# EAGLE design k1fm_wspr_tx-1.0 (EAGLE 9.2.2)
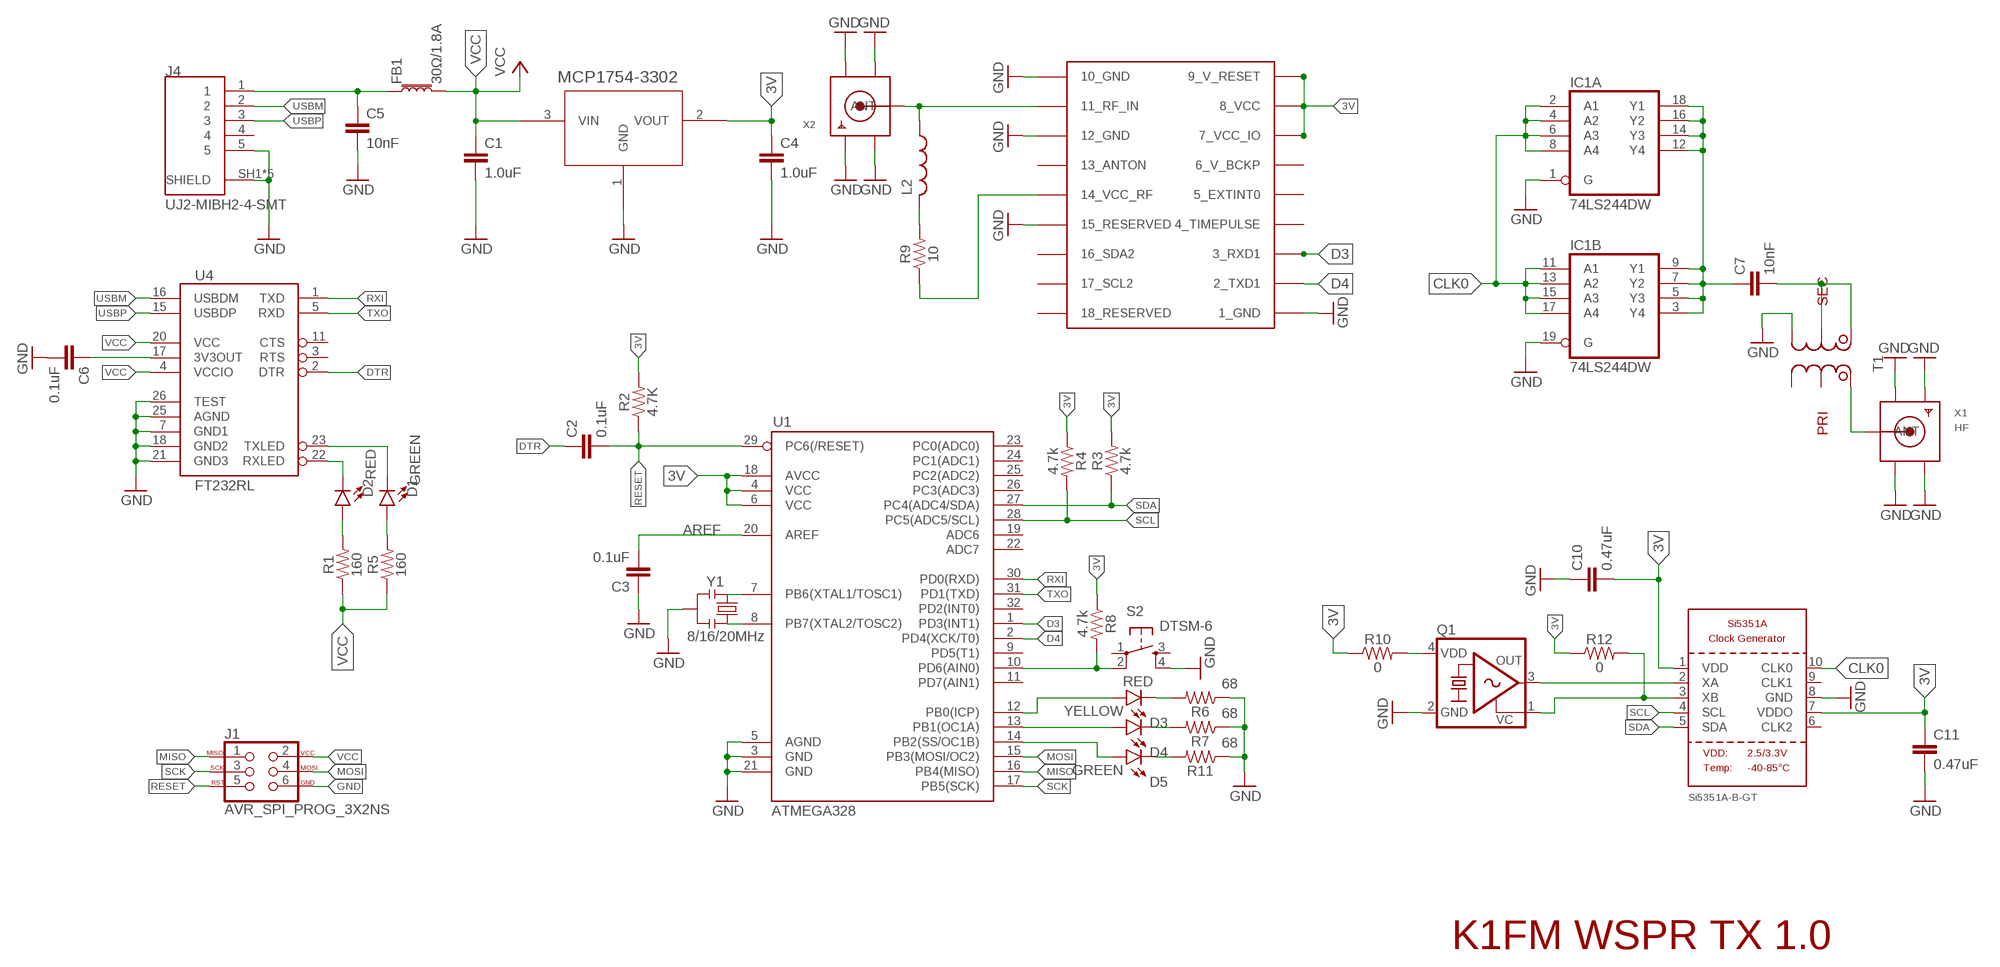
[diagram p0: schematic, sheet 1]

## Parts
C1  1.0uF  1.0UF-0603-16V-10%  [0603]
C2  0.1uF  0.1UF-0603-25V-5%  [0603]
C3  0.1uF  0.1UF-0603-25V-5%  [0603]
C4  1.0uF  1.0UF-0603-16V-10%  [0603]
C5  10nF  1.0UF-0603-16V-10%  [0603]
C6  0.1uF  0.1UF-0603-25V-5%  [0603]
C7  10nF  1.0UF-0603-16V-10%  [0603]
C10  0.47uF  0.1UF-0603-25V-5%  [0603]
C11  0.47uF  0.1UF-0603-25V-5%  [0603]
D1  GREEN  LED0603  [LED-0603]
D2  RED  LED0603  [LED-0603]
D3  RED  LED0603  [LED-0603]
D4  YELLOW  LED0603  [LED-0603]
D5  GREEN  LED0603  [LED-0603]
FB1  30Ω/1.8A  FERRITE_BEAD-0603  [0603]
GPS1  UBLOX_MAX  [UBLOX_MAX]
IC1  74LS244DW  [SO20W]
J1  AVR_SPI_PROG_3X2NS  [2X3-NS]
J4  UJ2-MIBH2-4-SMT  [CUI_UJ2-MIBH2-4-SMT]
L2  INDUCTOR_0402_M  [RESC0402_M]
Q1  KXO-VCXO-SINE-84  [3.2X2.5_KXO-84]
R1  160  4.7KOHM-0603-1/10W-1%  [0603]
R2  4.7K  10KOHM-0603-1/10W-1%  [0603]
R3  4.7k  4.7KOHM-0603-1/10W-1%  [0603]
R4  4.7k  4.7KOHM-0603-1/10W-1%  [0603]
R5  160  4.7KOHM-0603-1/10W-1%  [0603]
R6  68  4.7KOHM-0603-1/10W-1%  [0603]
R7  68  4.7KOHM-0603-1/10W-1%  [0603]
R8  4.7k  4.7KOHM-0603-1/10W-1%  [0603]
R9  10  10KOHM-0603-1/10W-1%  [0603]
R10  0  4.7KOHM-0603-1/10W-1%  [0603]
R11  68  4.7KOHM-0603-1/10W-1%  [0603]
R12  0  4.7KOHM-0603-1/10W-1%  [0603]
S2  DTSM-6  [DTSM-6]
T1  TT1-6  [KK81]
U1  ATMEGA328  ATMEGA168  [TQFP32-08]
U2  Si5351A-B-GT  SI5351A  [MSOP10]
U3  MCP1754X-XXXXX/C  [SOT-23A_MC]
U4  FT232RL  FT232RL-BASICSSOP  [SSOP28DB]
X1  HF  SMACONNECTOR_EDGE  [SMA_EDGELAUNCH]
X2  SMACONNECTOR_EDGE  [SMA_EDGELAUNCH]
Y1  8/16/20MHz  RESONATOR1:1  [RESONATOR-SMD-1:1]

## Nets
3V: C4.1 C10.2 C11.1 GPS1.7_VCC_IO GPS1.8_VCC GPS1.9_V_RESET R2.2 R3.2 R4.1 R8.1 R10.1 R12.1 U1.4(VCC) U1.6(VCC) U1.18(AVCC) U2.1(VDD) U2.7(VDDO) U3.2(VOUT)
AREF: C3.2 U1.20(AREF)
CLK0: IC1.2(A:A1) IC1.4(A:A2) IC1.6(A:A3) IC1.8(A:A4) IC1.11(B:A1) IC1.13(B:A2) IC1.15(B:A3) IC1.17(B:A4) U2.10(CLK0)
D3: GPS1.3_RXD1 U1.1(PD3(INT1))
D4: GPS1.2_TXD1 U1.2(PD4(XCK/T0))
DTR: C2.1 U4.2(DTR)
GND: C1.2 C3.1 C4.2 C5.2 C6.2 C10.1 C11.2 GPS1.1_GND GPS1.10_GND GPS1.12_GND GPS1.15_RESERVED IC1.1(A:G) IC1.19(B:G) J1.6 J4.5 J4.SH1(SHIELD) J4.SH2(SHIELD) J4.SH3(SHIELD) J4.SH4(SHIELD) J4.SH5(SHIELD) Q1.2(GND) R6.1 R7.1 R11.1 S2.4 T1.1(S2) U1.3(GND) U1.5(AGND) U1.21(GND) U2.8(GND) U3.1(GND) U4.7(GND1) U4.18(GND2) U4.21(GND3) U4.25(AGND) U4.26(TEST) X1.GND@1(GND4) X1.GND@2(GND3) X1.GND@3(GND2) X1.GND@4(GND1) X2.GND@1(GND4) X2.GND@2(GND3) X2.GND@3(GND2) X2.GND@4(GND1) Y1.2
MISO: J1.1 U1.16(PB4(MISO))
MOSI: J1.4 U1.15(PB3(MOSI/OC2))
N$1: GPS1.11_RF_IN L2.1 X2.P(ANT)
N$2: D2.C U4.22(RXLED)
N$3: C7.1 IC1.3(B:Y4) IC1.5(B:Y3) IC1.7(B:Y2) IC1.9(B:Y1) IC1.12(A:Y4) IC1.14(A:Y3) IC1.16(A:Y2) IC1.18(A:Y1)
N$4: T1.4(P1) X1.P(ANT)
N$5: C7.2 T1.2(ST) T1.3(S1)
N$6: Q1.3(OUT) U2.2(XA)
N$7: D1.C U4.23(TXLED)
N$8: C5.1 FB1.1 J4.1
N$9: D2.A R1.2
N$10: D1.A R5.2
N$11: D3.A U1.12(PB0(ICP))
N$12: D4.A U1.13(PB1(OC1A))
N$13: D3.C R6.2
N$14: C6.1 U4.17(3V3OUT)
N$15: D4.C R7.2
N$16: R8.2 S2.2 U1.10(PD6(AIN0))
N$17: L2.2 R9.2
N$18: GPS1.14_VCC_RF R9.1
N$19: Q1.1(VC) R12.2 U2.3(XB)
N$20: Q1.4(VDD) R10.2
N$21: D5.A U1.14(PB2(SS/OC1B))
N$22: D5.C R11.2
N$28: U1.8(PB7(XTAL2/TOSC2)) Y1.3
N$29: U1.7(PB6(XTAL1/TOSC1)) Y1.1
RESET: C2.2 J1.5 R2.1 U1.29(PC6(/RESET))
RXI: U1.30(PD0(RXD)) U4.1(TXD)
SCK: J1.3 U1.17(PB5(SCK))
SCL: R4.2 U1.28(PC5(ADC5/SCL)) U2.4(SCL)
SDA: R3.1 U1.27(PC4(ADC4/SDA)) U2.5(SDA)
TXO: U1.31(PD1(TXD)) U4.5(RXD)
USBM: J4.2 U4.16(USBDM)
USBP: J4.3 U4.15(USBDP)
VCC: C1.1 FB1.2 J1.2 R1.1 R5.1 U3.3(VIN) U4.4(VCCIO) U4.20(VCC)
Unconnected: GPS1.4_TIMEPULSE GPS1.5_EXTINT0 GPS1.6_V_BCKP GPS1.13_ANTON GPS1.16_SDA2 GPS1.17_SCL2 GPS1.18_RESERVED J4.4 S2.1 S2.3 T1.5(PT) T1.6(P2) U1.9(PD5(T1)) U1.11(PD7(AIN1)) U1.19(ADC6) U1.22(ADC7) U1.23(PC0(ADC0)) U1.24(PC1(ADC1)) U1.25(PC2(ADC2)) U1.26(PC3(ADC3)) U1.32(PD2(INT0)) U2.6(CLK2) U2.9(CLK1) U4.3(RTS) U4.11(CTS)

## Notes on the sheet
- K1FM WSPR TX 1.0

## Power pins joined to a net without a drawn wire
GND: IC1.10(P:GND)
VCC: IC1.20(P:VCC)

## Library data of the parts
C1 C4 = SparkFun-Capacitors:1.0UF: 1µF ceramic capacitors A capacitor is a passive two-terminal electrical component used to store electrical energy temporarily in an electric field.; PROD_ID: CAP-00868
C2 C3 C6 = SparkFun-Capacitors:0.1UF: 0.1µF ceramic capacitors A capacitor is a passive two-terminal electrical component used to store electrical energy temporarily in an electric field.; PROD_ID: CAP-08604
C5 C7 = SparkFun-Capacitors:1.0UF: 1µF ceramic capacitors A capacitor is a passive two-terminal electrical component used to store electrical energy temporarily in an electric field.; PROD_ID: CAP-00868; VALUE: 1.0uF
C10 C11 = SparkFun-Capacitors:0.1UF: 0.1µF ceramic capacitors A capacitor is a passive two-terminal electrical component used to store electrical energy temporarily in an electric field.; PROD_ID: CAP-08604; VALUE: 0.1uF
D1-D5 = SparkFun-LED:LED: LED (Generic) Standard schematic elements and footprints for 5mm, 3mm, 1206, and 0603 sized LEDs. Generic LEDs with no color specified.
FB1 = SparkFun-Coils:FERRITE_BEAD: Ferrite Bead (blocks, cores, rings, chokes, etc.) Inductor with layers of ferrite used to suppress high frequencies. Often used to isolate high frequency noise. SparkFun Products: IOIO-OTG - V2.2 <https://www.sparkfun.com/products/13613> SparkFun SAMD21 Mini Breakout <https://www.sparkfun.com/products/13664> SparkFun 6 Degrees of Freedom Breakout - LSM6DS3 <https://www.sparkfun.com/products/13339> SparkFun SAMD21 Dev Breakout <https://www.sparkfun.com/products/13672>; PROD_ID: NDUC-07859
GPS1 = Ava:UBLOX_MAX: UBLOX MAX
IC1 = 74xx-us:74*244: Octal BUFFER and LINE DRIVER, 3-state
J1 = SparkFun-Connectors:AVR_SPI_PROG_3X2: AVR ISP 6 Pin This is the reduced ISP connector for AVR programming. Common on Arduino. This footprint will take up less PCB space and can be used with a 10-pin to 6-pin adapter such as SKU: BOB-08508 **Special note about "TEST_POINT" package. The stop mask is on the top side, so if you want your programming test points to be on the bottom of your board, make sure to place this package on the bottom side of the board. This also ensure that the orientation to program from the bottom side will be correct. SparkFun Products: SparkFun ISP Pogo Adapter <https://www.sparkfun.com/products/11591> - NS Tiny AVR Programmer <https://www.sparkfun.com/products/11801> -PTH
J4 = UJ2-MIBH2-4-SMT:UJ2-MIBH2-4-SMT: Micro B, USB 2.0, 1.8 A, Right Angle, Surface Mount (SMT), USB Receptacle; MANUFACTURER: CUI INC; PART_REV: 1.0; STANDARD: MANUFACTURER RECOMMENDATIONS
L2 = Nordic_nRF:INDUCTOR: Generic chip inductor
Q1 = crystal-geyer_V1_0:KXO-VCXO-SINE: VCXO : Sinewave - Serie Model Size l/w/h [mm] Frequency Range Frequency Stability Temp. Range [°C] Output AECQ 200 availabel Datasheet KXO-81 KXO-86 KXO-84 KXO-83 KXO-82 2.0/1.6/0.7 2.5/2.0/0.7 3.2/2.5/1.0 5.0/3.2/1.5 7.0/5.0/2.0 13,0 ~ 40,0 MHz 13,0 ~ 40,0 MHz 10,0 ~ 26,0 MHz 12,0 ~ 26,0 MHz 12,6 ~ 20,0 MHz ±10 … ±50ppm ±10 … ±50ppm ±10 … ±50ppm ±10 … ±50ppm ±10 … ±50ppm (*) -30°C …+75°C (*) -30°C …+75°C (*) -40°C …+85°C (*) -40°C …+85°C (*) -30°C …+80°C Sinewave Sinewave Sinewave Sinewave Sinewave - - - - - KXO-81.pdf <http://www.geyer-electronic.de/uploads/tx_userartikelfrequenz/GEYER-KXO-81-VCXO-sinewave.pdf> KXO-86.pdf <http://www.geyer-electronic.de/uploads/tx_userartikelfrequenz/GEYER-KXO-86-VCXO-sinewave.pdf> KXO-84.pdf <http://www.geyer-electronic.de/uploads/tx_userartikelfrequenz/GEYER-KXO-84-VCXO-sinewave.pdf> KXO-83.pdf <http://www.geyer-electronic.de/uploads/tx_userartikelfrequenz/GEYER-KXO-83-VCXO-sinewave.pdf> KXO-82.pdf <http://www.geyer-electronic.de/uploads/tx_userartikelfrequenz/GEYER-KXO-82-VCXO-sinewave.pdf> <http://www.geyer-electronic.de/fileadmin/template/img/logo-geyer-electronic.png> Details see: http://www.geyer-electronic.de/Frequenz-Produkte.9.0.html Created 2016-06-07, Hans Locher 2016 (C) Geyer Quartz Technology KXO81,KXO86,KXO84,KXO83,KXO82,2,0x1,6;2.0x1.6;2,5x2,0;2.5x2.0;3,2x2,5;3.2x2.5;5,0x3,2;5.0x3.2;7,0x5,0;7.0x5.0;2016;2520;3225;5032;7050
R1 R5-R7 R10-R12 = SparkFun-Resistors:4.7KOHM: 4.7kΩ resistor A resistor is a passive two-terminal electrical component that implements electrical resistance as a circuit element. Resistors act to reduce current flow, and, at the same time, act to lower voltage levels within circuits. - Wikipedia; PROD_ID: RES-07857; VALUE: 4.7k
R2 R9 = SparkFun-Resistors:10KOHM: 10kΩ resistor A resistor is a passive two-terminal electrical component that implements electrical resistance as a circuit element. Resistors act to reduce current flow, and, at the same time, act to lower voltage levels within circuits. - Wikipedia; PROD_ID: RES-00824; VALUE: 10k
R3 R4 R8 = SparkFun-Resistors:4.7KOHM: 4.7kΩ resistor A resistor is a passive two-terminal electrical component that implements electrical resistance as a circuit element. Resistors act to reduce current flow, and, at the same time, act to lower voltage levels within circuits. - Wikipedia; PROD_ID: RES-07857
S2 = switch-tact:DTSM-6
T1 = minicircuits:TT1-6
U1 = SparkFun:ATMEGA168
U2 = microbuilder:SI5351A: Si5351A 8kHz-160MHz I2C Clock Generator VDD: 2.5V or 3.3V Input Range: 25MHz or 27MHz XTAL User selectable internal input load capacitors: 6, 8 or 10 pF Output Impedance: 85 Ohm Output Load Capacitance: 5-15pF Operating Temperature: -40°C - 85°C Operating Current (3 outputs): 35mA Output buffer voltage (VDDO): 1.8, 2.5 or 3.3V Note: If VDDO is not used it should be connected to VDD. Unused clock out pins should be left floating.
U3 = MCP1754:MCP1754X-XXXXX/C
U4 = SparkFun-IC-Comms:FT232RL-BASIC: FT232RL USB UART This is the simplified version of the FT232RL unit. Only what you need, nothing you don't. FT232RL 4th Generation USB UART (USB <-> Serial) Controller. Datasheet <http://www.sparkfun.com/datasheets/IC/FT232R_v104.pdf> SparkFun Products Component <https://www.sparkfun.com/products/650> (COM-00650) SparkFun RedBot Mainboard <https://www.sparkfun.com/products/12097> (ROB-12097) SparkFun FTDI Basic Breakout - 5V <https://www.sparkfun.com/products/9716> (DEV-09716) SparkFun FTDI Basic Breakout - 3.3V <https://www.sparkfun.com/products/9873> (DEV-09873) Bus Pirate - v3.6a <https://www.sparkfun.com/products/12942> (TOL-12942) SparkFun USB to Serial Breakout - FT232RL <https://www.sparkfun.com/products/12731> (BOB-12731) SparkFun PicoBoard <https://www.sparkfun.com/products/11888> (WIG-11888) SparkFun RFID USB Reader <https://www.sparkfun.com/products/9963> (SEN-09963) LilyPad FTDI Basic Breakout - 5V <https://www.sparkfun.com/products/10275> (DEV-10275) SparkFun Stepoko <https://www.sparkfun.com/products/13899> (ROB-13899); PROD_ID: IC-00870
X1 X2 = adafruit:SMACONNECTOR: SMA Connector 90° DIP SMA Connector, 50 Ohm (4UConnector: 07259)
Y1 = Testing:RESONATOR: Resonator Small SMD resonator. This is the itty bitty 10/20MHz resonators with built in caps. CSTCE10M0G55 and CSTCE20M0V53. Footprint for SMD has been used in SFE production for years, and does work okay. 1:1 is an attempt to get larger fillets on the sides so it will be easier to inspect these solders in our AOI machine. The pads have been minimized to match the actual metal under the resonator. To see this relation, it includes an image import of the bottom side of the component. Imported to scale on layer 200.

## Board
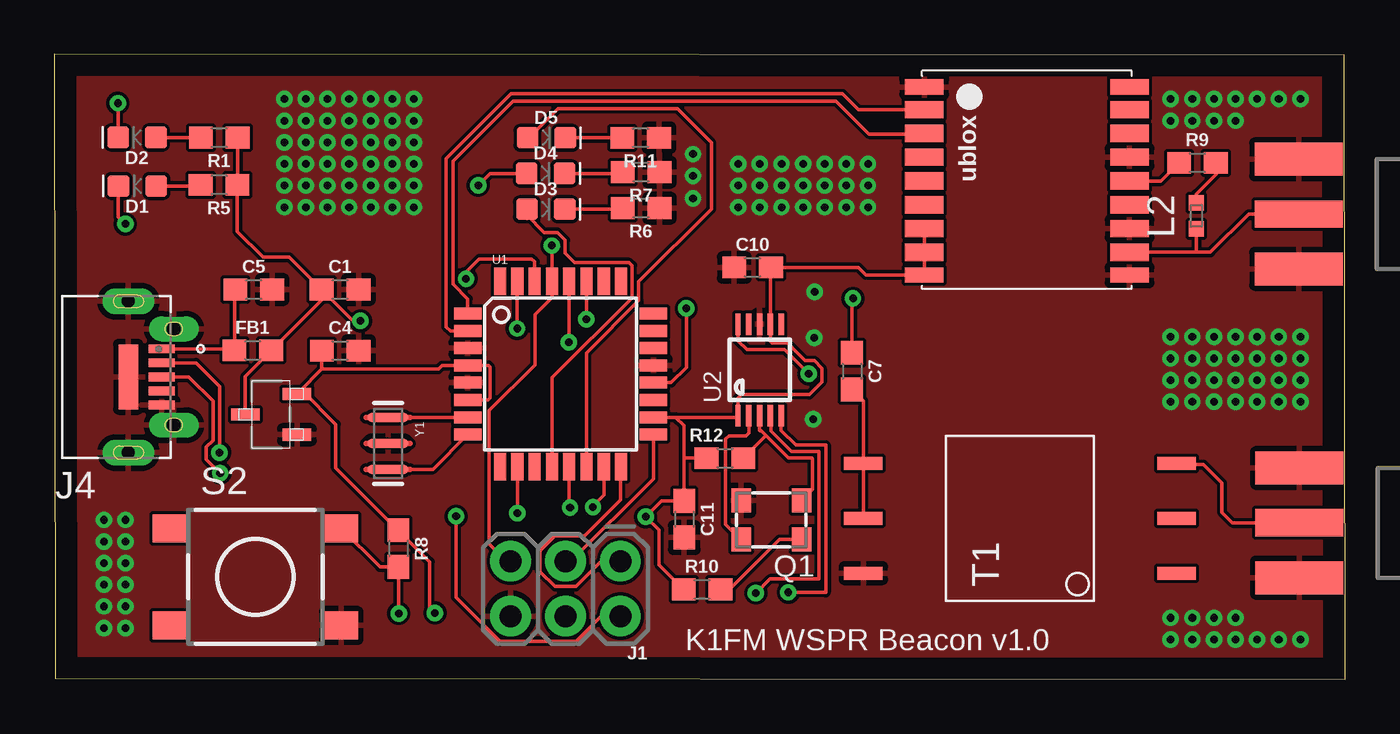
[diagram p1: board, top side]
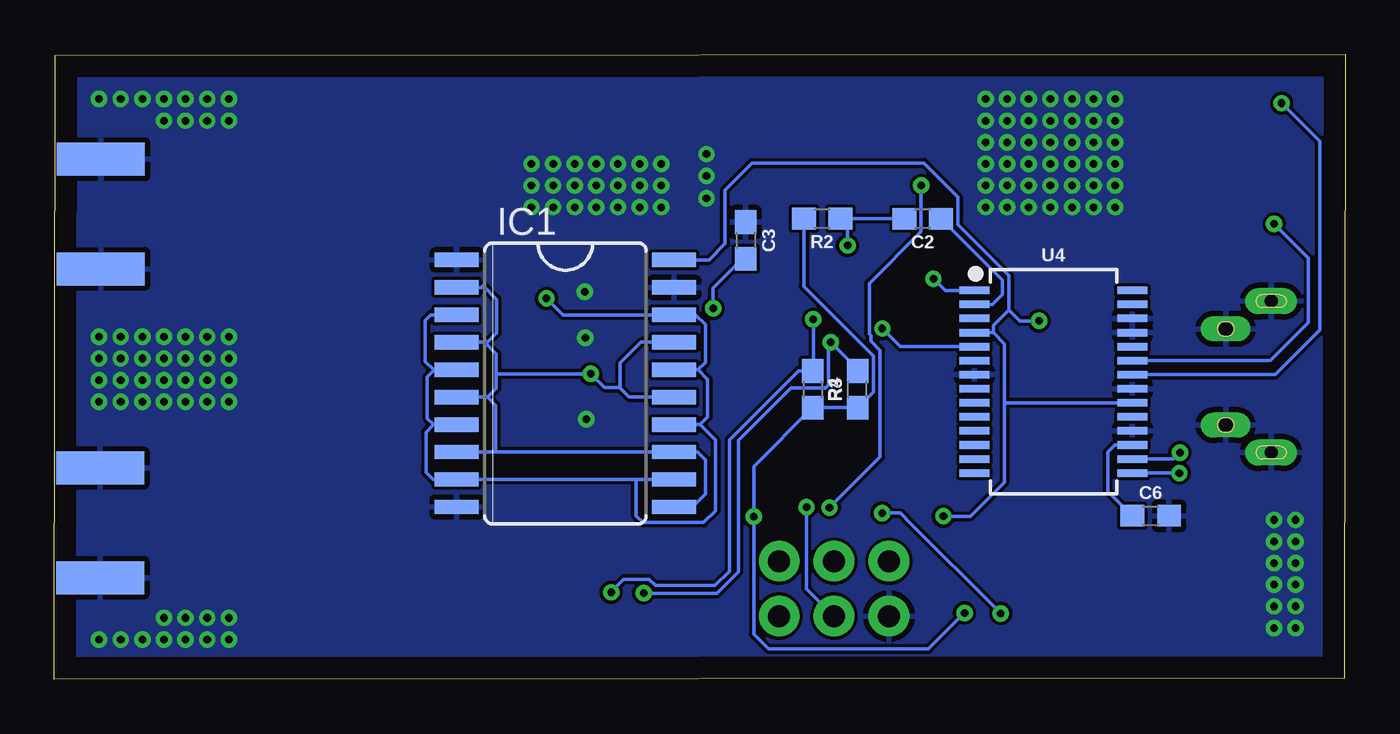
[diagram p2: board, bottom side, seen from below]

Size 59.73 x 28.94 mm. Coordinates in mm from the lower left corner, seen from the top.
Outline: 0.05,0.05 59.73,0 59.68,28.88 0,28.94 0.05,0.05
Copper layers (1*16): Top 0.035mm / dielectric 1.5mm / Bottom 0.035mm
Design rules "default": minimum track width 6mil, minimum drill 0.35mm, track to track 6mil, track to pad 6mil, pad to pad 6mil, via to via 6mil, smd to smd 6mil, copper to edge 40mil, drill to drill 6mil, minimum pad ring 10mil, minimum via ring 8mil, stop-mask expansion 4mil, vias tented up to drill 0mil, thermal gap 10mil

### Footprints (pad centres in the part's own frame; a part is rotated, then mirrored left to right if it is on the bottom)
0603 = smd 1.1 x 1: 1 -0.85,0; 2 0.85,0
LED-0603 = smd 1 x 1: A -0.877,0; C 0.877,0
UBLOX_MAX = smd 1.8 x 0.7: 1_GND 4.95,-4.4; 9_V_RESET 4.95,4.3; 10_GND -4.55,4.3; 18_RESERVED -4.55,-4.4 | smd 1.8 x 0.8: 2_TXD1 4.95,-3.35; 3_RXD1 4.95,-2.25; 4_TIMEPULSE 4.95,-1.15; 5_EXTINT0 4.95,-0.05; 6_V_BCKP 4.95,1.05; 7_VCC_IO 4.95,2.15; 8_VCC 4.95,3.25; 11_RF_IN -4.55,3.25; 12_GND -4.55,2.15; 13_ANTON -4.55,1.05; 14_VCC_RF -4.55,-0.05; 15_RESERVED -4.55,-1.15; 16_SDA2 -4.55,-2.25; 17_SCL2 -4.55,-3.35
SO20W = smd 0.66 x 2.032: 1 -5.715,-5.029; 2 -4.445,-5.029; 3 -3.175,-5.029; 4 -1.905,-5.029; 5 -0.635,-5.029; 6 0.635,-5.029; 7 1.905,-5.029; 8 3.175,-5.029; 9 4.445,-5.029; 10 5.715,-5.029; 11 5.715,5.029; 12 4.445,5.029; 13 3.175,5.029; 14 1.905,5.029; 15 0.635,5.029; 16 -0.635,5.029; 17 -1.905,5.029; 18 -3.175,5.029; 19 -4.445,5.029; 20 -5.715,5.029
2X3-NS = drill 1.016 pad 1.88: 1 -2.54,-1.27; 2 -2.54,1.27; 3 0,-1.27; 4 0,1.27; 5 2.54,-1.27; 6 2.54,1.27
CUI_UJ2-MIBH2-4-SMT = smd 1.2 x 0.4: 1 0,0; 2 0,-0.65; 3 0,-1.3; 4 0,-1.95; 5 0,-2.6 | drill 0.6 pad 1.2 long: SH1 -1.55,2.2; SH4 -1.55,-4.8 | drill 0.65 pad 1.05 long: SH2 0.55,0.925; SH5 0.55,-3.525 | smd 0.9 x 3: SH3 -1.55,-1.3
RESC0402_M = smd 0.7 x 0.7: 1 -0.6,0; 2 0.6,0
3.2X2.5_KXO-84 = smd 0.9 x 1.1: 1 -1.4,-0.9; 2 1.4,-0.9; 3 1.4,0.9; 4 -1.4,0.9
DTSM-6 = smd 1.55 x 1.3: 1 -3.975,2.25; 2 3.975,2.25; 3 -3.975,-2.25; 4 3.975,-2.25
KK81 = smd 0.61 x 1.778: 1 -2.54,7.239; 2 0,7.239; 3 2.54,7.239; 4 2.54,-7.239; 5 0,-7.239; 6 -2.54,-7.239
TQFP32-08 = smd 1.27 x 0.559: 1 -4.293,2.8; 2 -4.293,2; 3 -4.293,1.2; 4 -4.293,0.4; 5 -4.293,-0.4; 6 -4.293,-1.2; 7 -4.293,-2; 8 -4.293,-2.8; 17 4.293,-2.8; 18 4.293,-2; 19 4.293,-1.2; 20 4.293,-0.4; 21 4.293,0.4; 22 4.293,1.2; 23 4.293,2; 24 4.293,2.8 | smd 0.559 x 1.27: 9 -2.8,-4.293; 10 -2,-4.293; 11 -1.2,-4.293; 12 -0.4,-4.293; 13 0.4,-4.293; 14 1.2,-4.293; 15 2,-4.293; 16 2.8,-4.293; 25 2.8,4.293; 26 2,4.293; 27 1.2,4.293; 28 0.4,4.293; 29 -0.4,4.293; 30 -1.2,4.293; 31 -2,4.293; 32 -2.8,4.293
MSOP10 = smd 0.25 x 1: 1 -1,-2.113; 2 -0.5,-2.113; 3 0,-2.113; 4 0.5,-2.113; 5 1,-2.113; 6 1,2.113; 7 0.5,2.113; 8 0,2.113; 9 -0.5,2.113; 10 -1,2.113
SOT-23A_MC = smd 0.559 x 1.321: 1 -0.94,-1.194; 2 0.94,-1.194; 3 0,1.194
SSOP28DB = smd 0.348 x 1.397: 1 -4.225,-3.656; 2 -3.575,-3.656; 3 -2.925,-3.656; 4 -2.275,-3.656; 5 -1.625,-3.656; 6 -0.975,-3.656; 7 -0.325,-3.656; 8 0.325,-3.656; 9 0.975,-3.656; 10 1.625,-3.656; 11 2.275,-3.656; 12 2.925,-3.656; 13 3.575,-3.656; 14 4.225,-3.656; 15 4.225,3.656; 16 3.575,3.656; 17 2.925,3.656; 18 2.275,3.656; 19 1.625,3.656; 20 0.975,3.656; 21 0.325,3.656; 22 -0.325,3.656; 23 -0.975,3.656; 24 -1.625,3.656; 25 -2.275,3.656; 26 -2.925,3.656; 27 -3.575,3.656; 28 -4.225,3.656
SMA_EDGELAUNCH = smd 4.064 x 1.524: GND@1 2.032,-2.54; GND@2 2.032,2.54 | smd 4.064 x 1.524 bottom: GND@3 2.032,2.54; GND@4 2.032,-2.54 | smd 4.064 x 1.27: P 2.032,0
RESONATOR-SMD-1:1 = smd 0.45 x 1.905: 1 -1.2,0; 2 0,0; 3 1.2,0

### Placement (x,y rotation side)
C1  13.23,18.04 0 top
C2  19.55,21.31 180 bottom
C3  27.74,20.31 270 bottom
C4  13.23,15.21 0 top
C5  9.24,18.04 0 top
C6  9.01,7.57 0 bottom
C7  36.9,14.26 270 top
C10  32.31,19.06 0 top
C11  29.15,7.42 270 top
D1  3.85,22.83 180 top
D2  3.84,25.08 180 top
D3  22.75,21.76 0 top
D4  22.74,23.41 0 top
D5  22.77,25.06 0 top
FB1  9.19,15.22 0 top
GPS1  45.19,23.01 180 top
IC1  36.08,13.7 270 bottom
J1  23.66,4.2 180 top
J4  4.99,15.3 0 top
L2  52.83,21.45 90 top
Q1  33.17,7.38 180 top
R1  7.64,25.07 180 top
R2  24.2,21.32 180 bottom
R3  24.65,13.42 270 bottom
R4  22.57,13.42 90 bottom
R5  7.63,22.88 180 top
R6  27.15,21.81 180 top
R7  27.15,23.47 180 top
R8  15.92,6.06 270 top
R9  52.88,23.9 0 top
R10  29.97,4.17 0 top
R11  27.13,25.06 180 top
R12  31.03,10.24 0 top
S2  9.31,4.75 0 top
T1  44.67,7.46 90 top
U1  23.43,14.13 0 top
U2  32.63,14.32 0 top
U3  10.04,12.26 90 top
U4  13.51,13.78 270 bottom
X1  59.63,7.25 180 top
X2  59.6,21.53 180 top
Y1  15.45,10.92 270 top

### Tracks (layer width: path | path; a pad name or v marks a point on that pad's centre or on a via)
3V  (via drill 0.35)
  Top 0.152: C4.1 12.38,14.36 | 12.38,14.36 11.35,13.32 | 11.35,13.32 U3.2 11.26,13.18 | C11.1 29.16,8.28 | C11.1 29.15,10.26 | 29.15,10.26 29.15,11.07 29.12,11.07 29.12,11.75 28.74,12.13 | 28.74,12.13 U1.18 | C10.2 33.13,19.04 U2.7 33.13,15.64 33.21,15.57 33.91,15.57 34.73,14.75 35.16,14.75 35.51,14.39 35.51,13.77 34.93,13.18 31.79,13.18 31.63,13.02 U2.1 31.55,12.13 28.74,12.13 | GPS1.7_VCC_IO GPS1.8_VCC GPS1.9_V_RESET 37.55,18.71 37.2,19.06 C10.2 | C10.2 33.23,19.14 | 19.08,12.92 19.1,12.9 U1.6 20.06,12.93 20.16,13.02 20.16,14.47 20.09,14.53 U1.4 17.95,14.52 17.78,14.36 12.38,14.36 | v27.36,7.53 | C11.1 28.1,8.27 v27.36,7.53 | R10.1 27.98,5.3 27.98,6.91 v27.36,7.53 | 11.35,13.32 11.52,13.32 13.03,11.8 13.03,9.79 R8.1 17.38,5.45 17.38,3.31 v17.61,3.08 | R12.1 29.17,10.24 29.15,10.26
  Bottom 0.152: R4.1 R3.2 27.36,9.86 v27.36,7.53 27.36,2.1 26.68,1.41 19.28,1.41 v17.61,3.08 | R4.1 | 25.05,21.21 R2.2 25.05,18.18 21.84,14.97 21.84,13.3 R4.1
AREF  (via drill 0.35)
  Top 0.152: U1.20 28.54,13.73 29.24,14.43 v29.24,17.16
  Bottom 0.152: v29.24,17.16 29.24,18.11 27.88,19.46 C3.2
CLK0  (via drill 0.35)
  Top 0.152: v34.91,14.14 33.79,15.26 32.04,15.26 31.63,15.67 U2.10
  Bottom 0.152: 39.68,13.06 IC1.6 | IC1.13 31.08,10.55 | IC1.17 32.58,15.6 33.54,14.64 33.54,13.51 | 33.54,13.51 33.56,13.49 33.13,13.06 IC1.15 | IC1.13 31.07,10.5 | IC1.11 30.2,7.98 29.59,8.59 29.59,10.15 29.97,10.52 IC1.13 | 39.68,13.06 39.27,13.47 39.27,14.16 | 41.05,15.55 IC1.4 39.82,15.6 | 39.27,14.16 39.27,15.06 39.82,15.6 | IC1.2 39.96,18.14 39.88,18.21 39.25,17.58 39.25,16.04 39.69,15.6 39.82,15.6 | 33.54,13.51 34.27,13.51 v34.91,14.14 39.25,14.14 39.27,14.16 | 39.68,13.06 39.3,12.68 39.3,10.52 | 41.06,10.47 41.08,10.5 | 41.08,10.5 IC1.8 | IC1.13 39.3,10.52 | 39.3,10.52 41.06,10.52 41.08,10.5 | 39.3,10.52
D3
  Top 0.152: GPS1.3_RXD1 40.22,25.24 37.69,25.24 36.17,26.75 21.23,26.75 18.45,23.97 18.45,18.29 19.13,17.61 U1.1
D4
  Top 0.152: U1.2 18.36,16.13 18.34,16.11 18.14,16.32 18.14,24.11 21.13,27.1 36.47,27.1 37.2,26.36 GPS1.2_TXD1
DTR
  Bottom 0.152: C2.1 15.87,18.48 15.87,17.82 16.34,17.35 U4.2
GND  (via drill 0.35)
  Top 0.152: C10.1 31.26,18.87
  other vias: 35.18,17.93 35.16,15.81 33.65,21.85 34.65,21.85 35.65,21.85 36.65,21.85 32.65,21.85 31.65,21.85 37.65,21.85 37.65,22.85 36.65,22.85 35.65,22.85 34.65,22.85 33.65,22.85 32.65,22.85 31.65,22.85 31.65,23.85 32.65,23.85 33.65,23.85 34.65,23.85 35.65,23.85 36.65,23.85 37.65,23.85 12.65,21.85 13.65,21.85 14.65,21.85 15.65,21.85 11.65,21.85 10.65,21.85 16.65,21.85 16.65,22.85 15.65,22.85 14.65,22.85 13.65,22.85 12.65,22.85 11.65,22.85 10.65,22.85 10.65,23.85 11.65,23.85 12.65,23.85 13.65,23.85 14.65,23.85 15.65,23.85 16.65,23.85 12.65,24.85 13.65,24.85 14.65,24.85 15.65,24.85 11.65,24.85 10.65,24.85 16.65,24.85 16.65,25.85 15.65,25.85 14.65,25.85 13.65,25.85 12.65,25.85 11.65,25.85 10.65,25.85 10.65,26.85 11.65,26.85 12.65,26.85 13.65,26.85 14.65,26.85 15.65,26.85 16.65,26.85 53.65,12.85 52.65,12.85 51.65,12.85 51.65,13.85 52.65,13.85 53.65,13.85 52.65,14.85 53.65,14.85 51.65,14.85 53.65,15.85 52.65,15.85 51.65,15.85 57.65,12.85 56.65,12.85 55.65,12.85 54.65,12.85 54.65,13.85 55.65,13.85 56.65,13.85 57.65,13.85 56.65,14.85 57.65,14.85 55.65,14.85 54.65,14.85 57.65,15.85 56.65,15.85 55.65,15.85 54.65,15.85 54.65,25.85 53.65,25.85 52.65,25.85 51.65,25.85 51.65,26.85 52.65,26.85 53.65,26.85 54.65,26.85 55.65,26.85 56.65,26.85 57.65,26.85 57.65,1.85 56.65,1.85 55.65,1.85 54.65,1.85 53.65,1.85 52.65,1.85 51.65,1.85 51.65,2.85 52.65,2.85 53.65,2.85 54.65,2.85 29.55,24.31 29.55,23.3 29.55,22.26 35.11,12.04 3.31,2.38 2.31,2.38 3.31,3.38 2.31,3.38 2.31,4.38 3.31,4.38 3.31,5.38 2.31,5.38 3.31,6.38 2.31,6.38 2.31,7.38 3.31,7.38
  pour Top: 0.09,28.82 59.58,28.82 59.63,28.77 59.63,0.09 59.63,0.09 0.14,0.09 0.12,0.07
  pour Bottom: -0.01,28.94 59.58,28.94 59.66,28.86 59.66,0.03 59.68,0.02 0.09,0.02 0.06,0.04
MISO
  Top 0.152: U1.16 26.2,9.81 26.2,8.3 24.54,6.64 23.17,6.64 22.49,5.95 22.49,4.99 23.17,4.3 24.14,4.3 25.31,5.47 J1.1
MOSI  (via drill 0.35)
  Top 0.152: v24.93,7.98 24.93,8.03 25.43,8.53 U1.15
  Bottom 0.152: J1.4 24.93,4.2 v24.93,7.98
N$1
  Top 0.152: 57.55,21.51 X2.P 55.25,21.53 53.48,19.76 52.81,19.76 | 52.94,20.73 L2.1 52.83,19.79 52.81,19.76 | GPS1.11_RF_IN 52.81,19.76
N$2  (via drill 0.35)
  Top 0.152: D2.C v2.96,26.65 v2.95,26.66
  Bottom 0.152: U4.22 3.25,14.1 1.19,16.17 1.19,24.9 v2.95,26.66
N$3  (via drill 0.35)
  Top 0.152: v36.95,17.63 36.9,17.58 C7.1
  Bottom 0.152: v36.95,17.63 36.19,16.87 IC1.18 30.06,16.87 29.6,16.41 29.6,14.67 29.94,14.33 | 29.94,14.33 IC1.16 | IC1.12 32.8,9.25 | 32.8,9.25 IC1.9 42.2,9.25 42.53,9.58 42.53,11.44 42.18,11.79 | IC1.7 42.18,11.79 | 42.16,14.32 41.12,14.32 IC1.5 | 42.16,14.32 42.47,14 42.47,12.09 42.18,11.79 | IC1.3 42.31,16.87 42.56,16.62 42.56,14.72 42.16,14.32 | IC1.14 29.86,11.79 | 32.8,9.25 32.8,7.58 32.48,7.26 29.68,7.26 29.14,7.8 29.14,11.07 29.86,11.79 | 29.94,14.33 29.5,13.89 29.5,12.15 29.86,11.79
N$4
  Top 0.152: T1.4 51.96,9.95 53.16,9.95 54.02,9.09 54.02,7.74 54.5,7.25 X1.P
N$5
  Top 0.152: T1.2 T1.3 37.43,12.89 C7.2
N$6
  Top 0.152: U2.2 32.13,11.41 31.99,11.27 31.22,11.27 31.06,11.12 31.06,7.18 Q1.3
N$7  (via drill 0.35)
  Top 0.152: D1.C 2.98,21.39 v3.3,21.07
  Bottom 0.152: v3.3,21.07 1.71,19.49 1.71,16.51 3.47,14.75 U4.23
N$8
  Top 0.152: J4.1 8.27,15.3 FB1.1 8.34,17.99 C5.1
N$9
  Top 0.152: R1.2 4.72,25.07 D2.A
N$10
  Top 0.152: R5.2 6.73,22.83 D1.A
N$11
  Top 0.152: U1.12 23.04,9.85 23.04,13.96 26.73,17.65 26.73,19.15 26.6,19.29 24.07,19.29 23.64,19.72 23.64,20.33 23.28,20.68 22.67,20.68 21.87,21.48 | 21.87,21.33 21.87,21.48 | 21.87,21.48 D3.A
N$12  (via drill 0.35)
  Top 0.152: U1.13 23.83,7.99 v23.86,7.95 | v19.62,22.86 20.16,23.4 21.84,23.4 D4.A
  Bottom 0.152: v23.86,7.95 21.52,10.3 21.52,15.23 21.95,15.66 21.95,15.92 22.02,15.99 22.02,18.32 19.62,20.72 v19.62,22.86
N$13
  Top 0.152: R6.2 26.28,21.83 | 26.28,21.83 26.26,21.85 | D3.C 26.21,21.76 26.28,21.83
N$14
  Bottom 0.152: C6.1 11,8.71 11,10.52 10.66,10.85 U4.17
N$15
  Top 0.152: R7.2 26.24,23.41 D4.C
N$16  (via drill 0.35)
  Top 0.152: U1.10 v21.43,7.7 | S2.2 15.08,5.21 R8.2 15.94,5.19 v15.94,3.05
  Bottom 0.152: v21.43,7.7 20.58,7.7 20.32,7.44 20.32,7.43 v15.94,3.05
N$17
  Top 0.152: L2.2 52.83,22.45 53.76,23.39 53.76,23.87 R9.2
N$18
  Top 0.152: GPS1.14_VCC_RF 51.19,23.06 R9.1
N$19
  Top 0.152: 34.29,8.56 Q1.1 35.08,8.79 35.08,10.21 35.05,10.24 33.97,10.24 32.96,11.26 | 32.96,11.26 32.72,11.49 32.67,11.49 32.63,11.53 U2.3 | R12.2 32.9,11.26 32.96,11.26
N$20
  Top 0.152: R10.2 31.23,4.17 33.54,6.48 Q1.4
N$21
  Top 0.152: U1.14 24.63,15.11 27.04,17.53 27.04,18.41 30.4,21.77 30.4,24.83 28.83,26.41 23.3,26.41 21.96,25.06 D5.A
N$22
  Top 0.152: R11.2 | D5.C R11.2 | R11.2
N$28
  Top 0.152: Y1.3 17.52,9.72 U1.8
N$29
  Top 0.152: Y1.1 19.12,12.12 U1.7
RESET  (via drill 0.35)
  Top 0.152: J1.5 20.93,5.47 20.12,6.28 20.12,12.43 22.24,14.55 22.24,16.88 23.03,17.67 U1.29 v23.03,20.07 v23.03,20.08
  Bottom 0.152: C2.2 R2.1 | R2.1 | v23.03,20.08 23.03,21 R2.1
RXI  (via drill 0.35)
  Top 0.152: U1.30 22.23,19.32 22.09,19.46 19.67,19.46 19.05,18.84 v19.05,18.54
  Bottom 0.152: v19.05,18.54 18.51,18 U4.1
SCK
  Top 0.152: J1.3 23.9,5.47 27.72,9.29 U1.17
SCL  (via drill 0.35)
  Top 0.152: v23.81,15.6 23.81,18.4 U1.28 | U2.4 33.15,12.19 33.15,11.49 34.1,10.54 35.39,10.54 35.39,4.65 33.11,4.65 v32.46,4
  Bottom 0.152: R4.2 22.57,14.36 v23.81,15.6 23.92,15.49 23.92,13.63 24.05,13.49 25.65,13.49 28.08,11.06 28.08,4.98 29.07,4 v32.46,4
SDA  (via drill 0.35)
  Top 0.152: U1.27 24.63,16.67 v24.62,16.66 | U2.5 33.63,11.53 34.31,10.85 35.69,10.85 35.69,4.03 v33.96,4.03
  Bottom 0.152: v24.62,16.66 24.62,14.31 R3.1 25.3,14.27 28.49,11.08 28.49,5.01 29.15,4.35 31.92,4.35 32.21,4.64 33.38,4.64 33.96,4.06 v33.96,4.03
TXO  (via drill 0.35)
  Top 0.152: v21.42,16.24 U1.31
  Bottom 0.152: U4.5 20.58,15.4 v21.42,16.24
USBM  (via drill 0.35)
  Top 0.152: J4.2 6.57,14.65 7.65,13.57 v7.65,10.5
  Bottom 0.152: v7.65,10.5 7.95,10.2 U4.16
USBP  (via drill 0.35)
  Top 0.152: J4.3 6.23,14 7.35,12.88 7.35,11.05 7.05,10.75 7.05,10.19 v7.68,9.55
  Bottom 0.152: v7.68,9.55 U4.15
VCC  (via drill 0.35)
  Top 0.152: C1.1 12.38,17.56 FB1.2 8.84,14.03 U3.3 | 8.6,22.88 R5.1 8.48,20.73 9.67,19.54 10.88,19.54 C1.1 | 8.6,22.88 | R1.1 8.49,22.99 8.6,22.88 | J1.2 25.31,2.93 24.14,1.76 20.63,1.76 19.61,2.79 18.59,3.8 v18.59,7.55 | C1.1 13.83,16.59 v14.17,16.59
  Bottom 0.152: 16.29,16.05 15.76,15.53 15.76,12.76 | 15.76,12.76 15.76,9.12 17.34,7.55 v18.59,7.55 | U4.20 15.72,12.8 15.76,12.76 | 31.14,19.5 IC1.20 29.45,19.41 28.69,20.16 28.69,22.64 27.44,23.89 19.49,23.89 17.92,22.33 17.92,21.05 15.57,18.7 15.57,17.1 | 16.29,16.05 16.29,16.38 15.57,17.1 | U4.4 16.29,16.05 | v14.17,16.59 15.06,16.59 15.57,17.1

### Text on the board
tNames: K1FM WSPR Beacon v1.0